# Altium schematic sheet serpentine.SchDoc
size A4; SheetNumber: 3; SheetTotal: 5
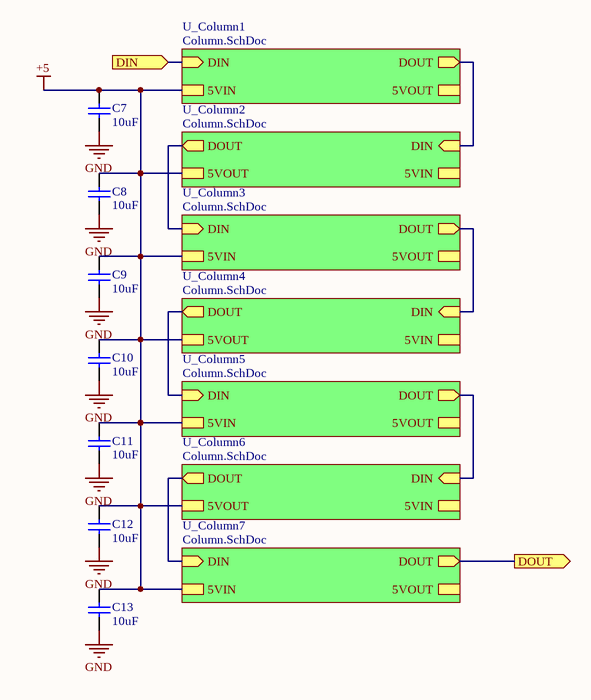
[diagram p0: serpentine.SchDoc]

## Parts
C7  10uF  [CAP1206]
C8  10uF  [CAP1206]
C9  10uF  [CAP1206]
C10  10uF  [CAP1206]
C11  10uF  [CAP1206]
C12  10uF  [CAP1206]
C13  10uF  [CAP1206]

## Sub-sheets
U_Column1 = Column.SchDoc: DIN (in), DOUT (out), 5VIN, 5VOUT
U_Column2 = Column.SchDoc: DIN (in), DOUT (out), 5VIN, 5VOUT
U_Column3 = Column.SchDoc: DIN (in), DOUT (out), 5VIN, 5VOUT
U_Column4 = Column.SchDoc: DIN (in), DOUT (out), 5VIN, 5VOUT
U_Column5 = Column.SchDoc: DIN (in), DOUT (out), 5VIN, 5VOUT
U_Column6 = Column.SchDoc: DIN (in), DOUT (out), 5VIN, 5VOUT
U_Column7 = Column.SchDoc: DIN (in), DOUT (out), 5VIN, 5VOUT

## Ports
DIN (in), DOUT (out)

## Nets
+5: C7.2 C8.2 C9.2 C10.2 C11.2 C12.2 C13.2 ; sheet U_Column1/5VIN, sheet U_Column2/5VOUT, sheet U_Column3/5VIN, sheet U_Column4/5VOUT, sheet U_Column5/5VIN, sheet U_Column6/5VOUT, sheet U_Column7/5VIN
GND: C7.1 C8.1 C9.1 C10.1 C11.1 C12.1 C13.1
DIN: port DIN, sheet U_Column1/DIN
DOUT: port DOUT, sheet U_Column7/DOUT
(unnamed): sheet U_Column1/DOUT, sheet U_Column2/DIN
(unnamed): sheet U_Column2/DOUT, sheet U_Column3/DIN
(unnamed): sheet U_Column3/DOUT, sheet U_Column4/DIN
(unnamed): sheet U_Column4/DOUT, sheet U_Column5/DIN
(unnamed): sheet U_Column5/DOUT, sheet U_Column6/DIN
(unnamed): sheet U_Column6/DOUT, sheet U_Column7/DIN

## Library data of the parts
C7-C13 = CAP: C342827; Value: 1µF; Rated voltage: 25V; Tolerance: 10%; Manufacturer: *; Manufacturer P/N: *; Order code Farnell: 1288202RL; Power: *; Technology: X5R; Temperature  Factor: *; Temperature Max: +125°C; Temperature Min: -55°C; STS Code: *